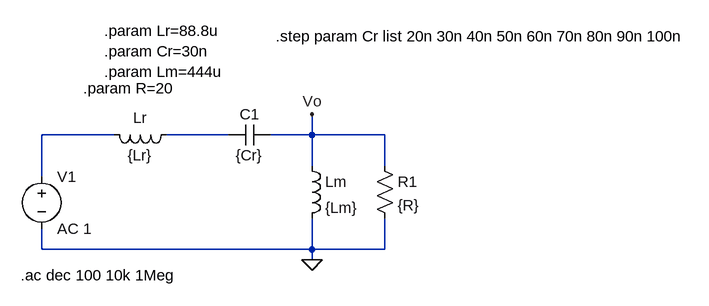
[diagram p0: schematic LLCTank.asc]
LLCTank.asc, the LTspice schematic file:
Version 4
SHEET 1 1000 680
WIRE 64 80 -48 80
WIRE 240 80 144 80
WIRE 368 80 368 48
WIRE 368 80 304 80
WIRE 480 80 368 80
WIRE 368 128 368 80
WIRE 480 128 480 80
WIRE -48 144 -48 80
WIRE -48 256 -48 224
WIRE 368 256 368 208
WIRE 368 256 -48 256
WIRE 480 256 480 208
WIRE 480 256 368 256
WIRE 368 272 368 256
FLAG 368 48 Vo
FLAG 368 272 0
SYMBOL voltage -48 128 R0
SYMATTR InstName V1
SYMATTR Value AC 1
SYMBOL ind 160 64 R90
WINDOW 0 5 56 VBottom 2
WINDOW 3 32 56 VTop 2
SYMATTR InstName Lr
SYMATTR Value {Lr}
SYMBOL cap 304 64 R90
WINDOW 0 0 32 VBottom 2
WINDOW 3 32 32 VTop 2
SYMATTR InstName C1
SYMATTR Value {Cr}
SYMBOL ind 352 112 R0
SYMATTR InstName Lm
SYMATTR Value {Lm}
SYMBOL res 464 112 R0
SYMATTR InstName R1
SYMATTR Value {R}
TEXT 48 -80 Left 2 !.param Lr=88.8u\n.param Cr=30n\n.param Lm=444u
TEXT 16 8 Left 2 !.param R=20
TEXT -80 296 Left 2 !.ac dec 100 10k 1Meg
TEXT 312 -72 Left 2 !.step param Cr list 20n 30n 40n 50n 60n 70n 80n 90n 100n

The netlist it stands for:
* LLCTank.asc
V1 N001 0 AC 1
Lr N002 N001 {Lr}
C1 Vo N002 {Cr}
Lm Vo 0 {Lm}
R1 Vo 0 {R}
.param Lr=88.8u
.param Cr=30n
.param Lm=444u
.param R=20
.ac dec 100 10k 1Meg
.step param Cr list 20n 30n 40n 50n 60n 70n 80n 90n 100n
.backanno
.end